# Altium schematic sheet MCU_REVB_4.SchDoc: Big-MCU
size 270 x 223 mm; Origin: Eagle; Date: 2023-01-13 8:42:14 AM; SheetNumber: 5; GateName_1: G$1; SymbolName_1: LETTER_L; LibraryName: frames; DeviceSetName: LETTER_L; GateName_2: G$2; SymbolName_2: DOCFIELD; Sheet: Sheet:; REV: REV:
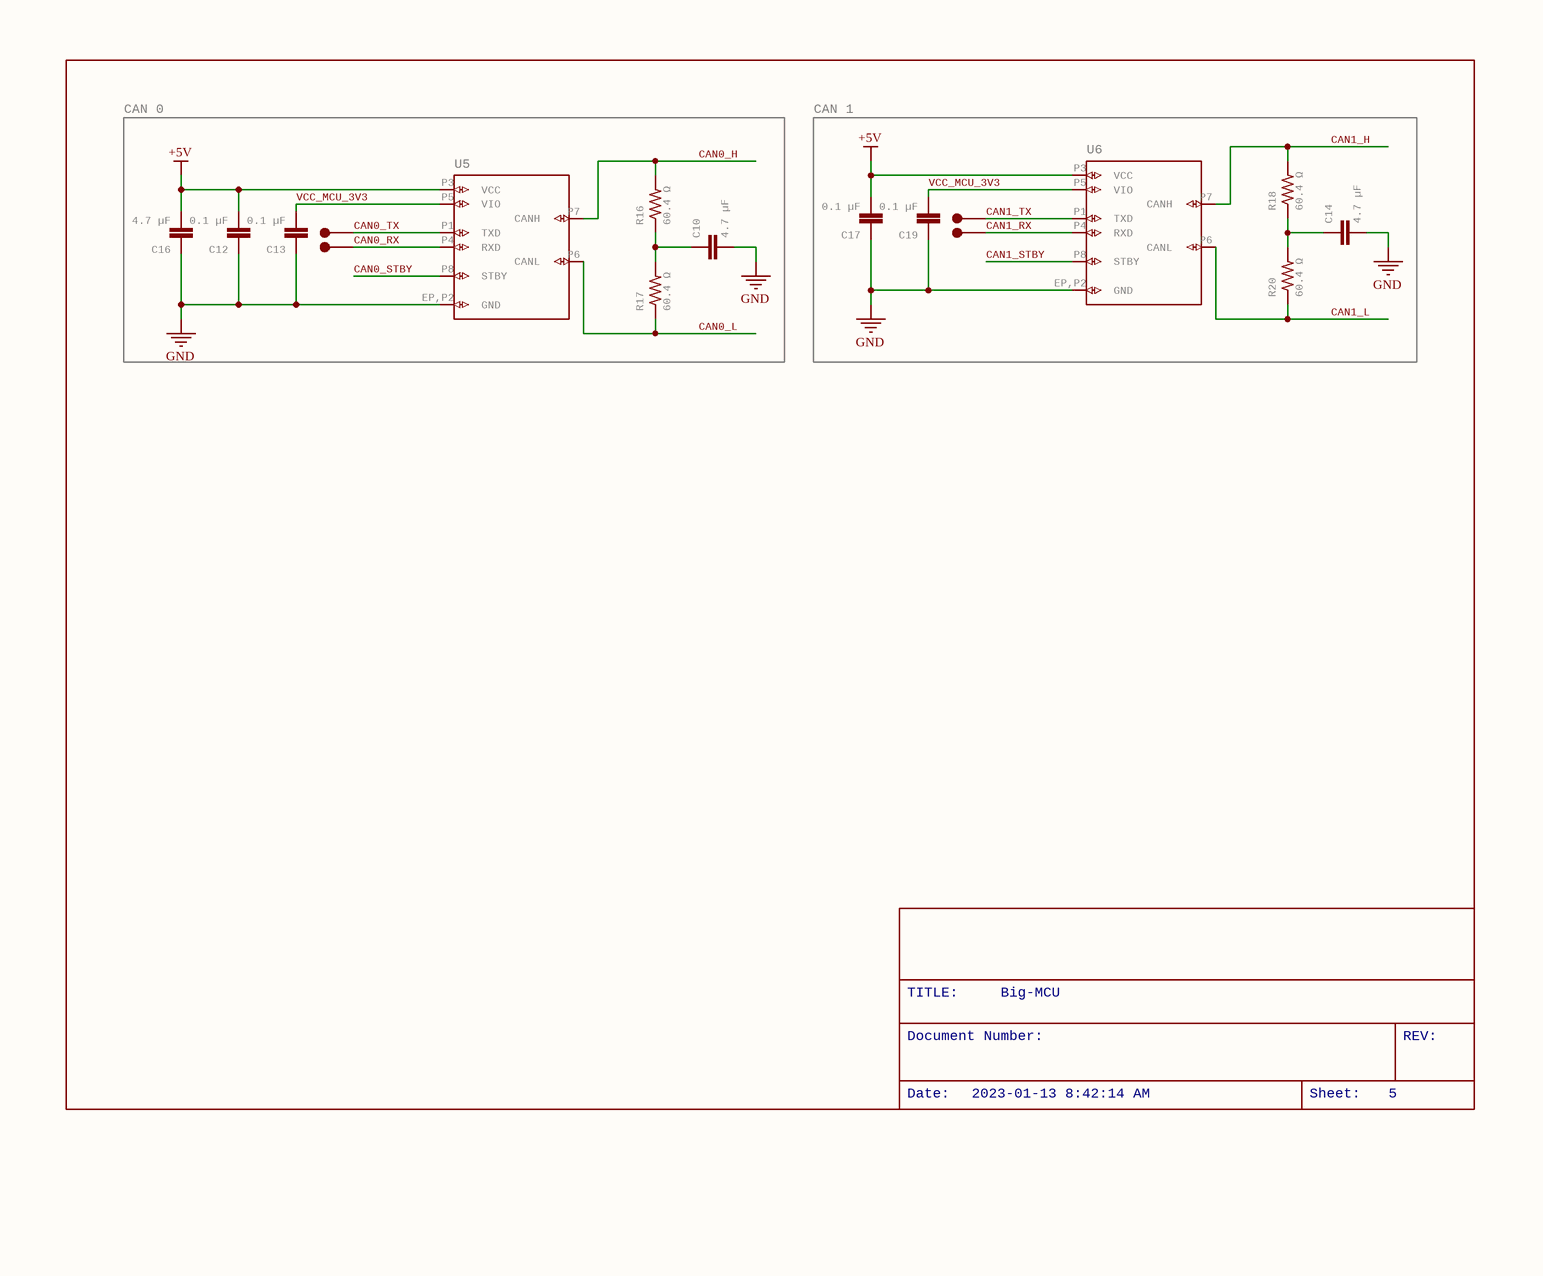
[diagram p0: MCU_REVB_4.SchDoc]

## Parts
C10  4.7 µF  [C0805]
C12  0.1 µF  [C0805]
C13  0.1 µF  [C0805]
C14  4.7 µF  [C0805]
C16  4.7 µF  [C0805]
C17  0.1 µF  [C0805]
C19  0.1 µF  [C0805]
R16  60.4 Ω  [C1206]
R17  60.4 Ω  [C1206]
R18  60.4 Ω  [C1206]
R20  60.4 Ω  [C1206]
TP17  5015  [KEYSTONE_5015]  (value not drawn)
TP18  5015  [KEYSTONE_5015]  (value not drawn)
TP19  5015  [KEYSTONE_5015]  (value not drawn)
TP20  5015  [KEYSTONE_5015]  (value not drawn)
U5  ATA6561  [FP-C04-057-OA-MFG]  (value not drawn)
U6  ATA6561  [FP-C04-057-OA-MFG]  (value not drawn)

## Blocks framed on the sheet
CAN 0: C10 C12 C13 C16 R16 R17 TP17 TP18 U5
CAN 1: C14 C17 C19 R18 R20 TP19 TP20 U6

## Nets
+5V: C12.2 C16.2 C17.2 U5.P3(VCC) U6.P3(VCC)
GND: C10.2 C12.1 C13.1 C14.2 C16.1 C17.1 C19.1 U5.EP,P2(GND) U6.EP,P2(GND)
CAN0_H: R16.2 U5.P7(CANH)
CAN0_L: R17.1 U5.P6(CANL)
CAN0_RX: TP17.1(TP) U5.P4(RXD)
CAN0_STBY: U5.P8(STBY)
CAN0_TX: TP18.1(TP) U5.P1(TXD)
CAN1_H: R18.2 U6.P7(CANH)
CAN1_L: R20.1 U6.P6(CANL)
CAN1_RX: TP20.1(TP) U6.P4(RXD)
CAN1_STBY: U6.P8(STBY)
CAN1_TX: TP19.1(TP) U6.P1(TXD)
VCC_MCU_3V3: C13.2 C19.2 U5.P5(VIO) U6.P5(VIO)
NetC10_1: C10.1 R16.1 R17.2
NetC14_1: C14.1 R18.1 R20.2

## Notes on the sheet
- TITLE:
- Big-MCU
- Document Number:
- REV:
- Date:
- 2023-01-13 8:42:14 AM
- Sheet:
- 5

## Library data of the parts
C10 C12-C14 C16 C17 C19 = C-EUC0805: CAPACITOR, European symbol; GateName_1: G$1; SymbolName_1: C-EU; POPULARITY: 88; DeviceName: C0805; LibraryName: rcl; DeviceSetName: C-EU; SPICEPREFIX: C
R16-R18 R20 = R-US_R1206: RESISTOR, American symbol; GateName_1: G$1; SymbolName_1: R-US; DeviceName: R1206; DeviceSetName: R-US_; POPULARITY: 19; LibraryName: rcl; SPICEPREFIX: R
TP17-TP20 = CMP-005-000003-3: GateName_1: G$1; MF: Keystone Electronics; SymbolName_1: 5015; LibraryName: MCU Board; DeviceSetName: 5015; AVAILABILITY: Unavailable; MOUSER-PURCHASE-URL: https://snapeda.com/shop?store=Mouser&id=48459; MP: 5015; Package: KEYSTONE_5015; PRICE: None; Component Type: Standard; Design Item ID: 5015; Pin Count: 1; Source: MCU Board.SCHLIB
U5 U6 = CMP-006-000003-2: ATA6561 Series 5 Mbit/s 3 to 5 V ±8 kV Standby Mode CAN Transceiver - SOIC-8; pin to pad: EP,P2>2 P1>1 P3>3 P4>4 P5>5 P6>6 P7>7 P8>8; GateName_1: G$1; Receiver Hysteresis: 120mV; Number of Transceivers: 1; Data Rate: 5Mbps; Max Supply Voltage: 5.5V; Min Supply Voltage: 4.5V; Max Supply Current: 5mA; SymbolName_1: ATA6561; LibraryName: MCU Board; DeviceSetName: ATA6561; Component Type: Standard; Pin Count: 8; Package: VDFN8; Design Item ID: ATA6561; Source: MCU Board.SCHLIB; Series: Automotive, AEC-Q100; Min Operating Temperature: -40°C; Mounting Technology: Surface Mount; Lead Free: Lead Free; Packaging: Cut Tape; Pins: 8; Max Operating Temperature: 150°C; RoHS Compliant: Yes; Case/Package: SOIC